# EAGLE schematic Sway (EAGLE 9.7.0)
SIM_ABSTOL: 1e-12; SIM_AC_SWEEP_TYPE: Dec; SIM_CHGTOL: 1e-15; SIM_GMIN: 1e-12; SIM_ITL1: 100; SIM_ITL2: 50; SIM_ITL4: 10; SIM_MAX_LIMIT: 2000; SIM_METHOD: TRAP; SIM_NUMPOINTS: 500; SIM_PIVREL: 1e-3; SIM_PIVTOL: 1e-13; SIM_RELTOL: 1e-3; SIM_RSHUNT: OFF; SIM_SRCSTEPS: 0; SIM_TEMPERATURE: 25.0; SIM_THEME: light; SIM_TRAN_AC_START: 1; SIM_TRTOL: 7; SIM_TYPE: Operating Point; SIM_VNTOL: 1e-6
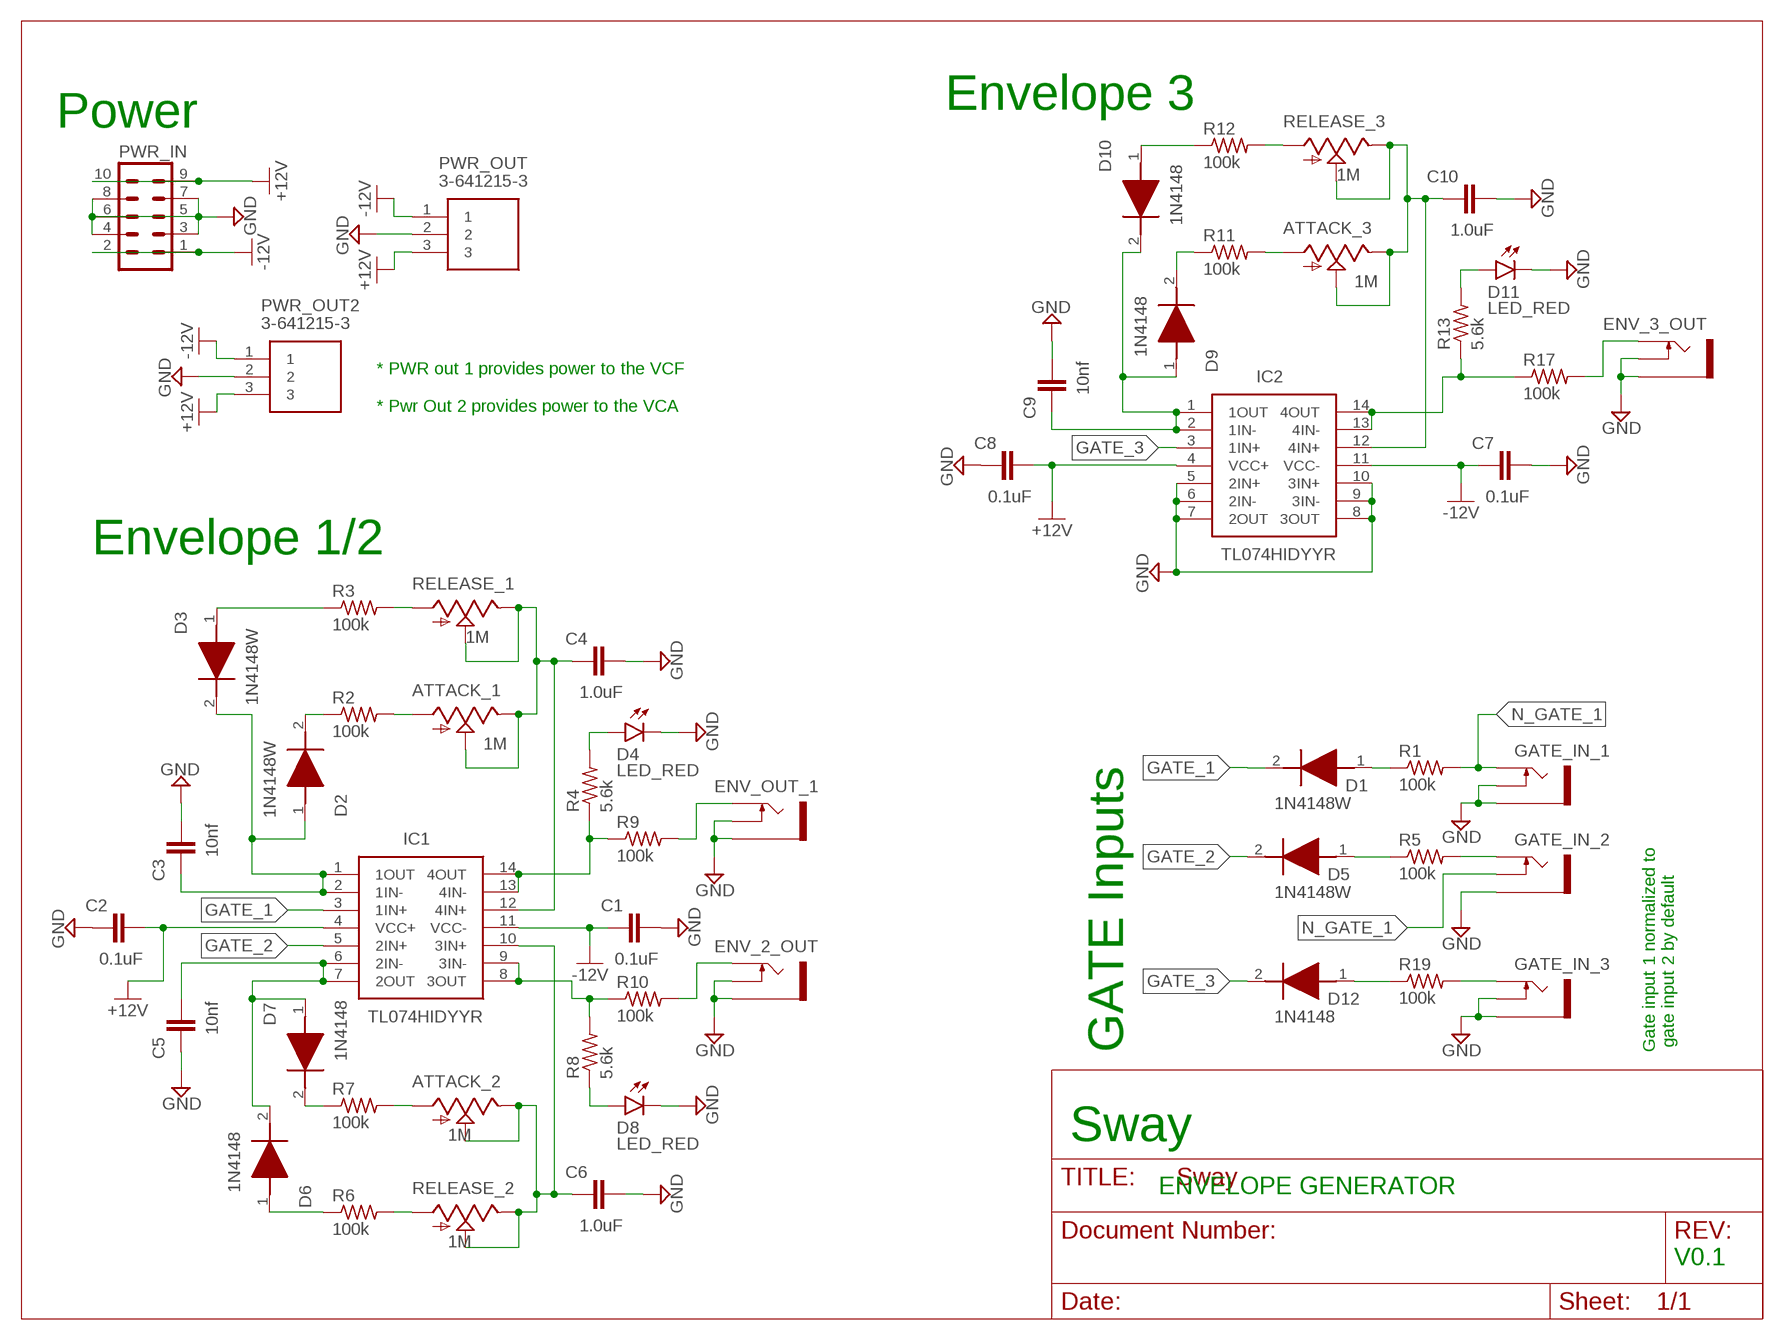
[diagram p0: schematic, sheet 1]

## Parts
ATTACK_1  1M  9MM_SNAP-IN_POT_  [9MM_SNAP-IN_POT]
ATTACK_2  1M  9MM_SNAP-IN_POT_  [9MM_SNAP-IN_POT]
ATTACK_3  1M  9MM_SNAP-IN_POT_  [9MM_SNAP-IN_POT]
C1  0.1uF  0.1UF-0402-16V-10%  [0402]
C2  0.1uF  0.1UF-0402-16V-10%  [0402]
C3  10nf  0.1UF-0402-16V-10%  [0402]
C4  1.0uF  1.0UF-0402-16V-10%  [0402]
C5  10nf  0.1UF-0402-16V-10%  [0402]
C6  1.0uF  1.0UF-0402-16V-10%  [0402]
C7  0.1uF  0.1UF-0402-16V-10%  [0402]
C8  0.1uF  0.1UF-0402-16V-10%  [0402]
C9  10nf  0.1UF-0402-16V-10%  [0402]
C10  1.0uF  1.0UF-0402-16V-10%  [0402]
D1  1N4148W  1N4148W-HG3_A-08  [SOD3716X135N]
D2  1N4148W  1N4148W-HG3_A-08  [SOD3716X135N]
D3  1N4148W  1N4148W-HG3_A-08  [SOD3716X135N]
D4  LED_RED  LED_RADIAL_RED  [LEDRD254W60D565H860B]
D5  1N4148W  1N4148W-HG3_A-08  [SOD3716X135N]
D6  1N4148  1N4148W-HG3_A-08  [SOD3716X135N]
D7  1N4148  1N4148W-HG3_A-08  [SOD3716X135N]
D8  LED_RED  LED_RADIAL_RED  [LEDRD254W60D565H860B]
D9  1N4148  1N4148W-HG3_A-08  [SOD3716X135N]
D10  1N4148  1N4148W-HG3_A-08  [SOD3716X135N]
D11  LED_RED  LED_RADIAL_RED  [LEDRD254W60D565H860B]
D12  1N4148  1N4148W-HG3_A-08  [SOD3716X135N]
ENV_2_OUT  THONKICONNNEW  [WQP-PJ301M-12_JACK]
ENV_3_OUT  THONKICONNNEW  [WQP-PJ301M-12_JACK]
ENV_OUT_1  THONKICONNNEW  [WQP-PJ301M-12_JACK]
GATE_IN_1  THONKICONNNEW  [WQP-PJ301M-12_JACK]
GATE_IN_2  THONKICONNNEW  [WQP-PJ301M-12_JACK]
GATE_IN_3  THONKICONNNEW  [WQP-PJ301M-12_JACK]
IC1  TL074HIDYYR  [SOP50P326X110-14N]
IC2  TL074HIDYYR  [SOP50P326X110-14N]
PWR_IN  EURO_POWER_HEADERREGULAR  [EURO_POWER_HEADER]
PWR_OUT  3-641215-3  [SHDR3W66P0X254_1X3_762X572X104]
PWR_OUT2  3-641215-3  [SHDR3W66P0X254_1X3_762X572X104]
R1  100k  R-US_CHIP-0402(1005-METRIC)  [RESC1005X40]
R2  100k  R-US_CHIP-0402(1005-METRIC)  [RESC1005X40]
R3  100k  R-US_CHIP-0402(1005-METRIC)  [RESC1005X40]
R4  5.6k  R-US_CHIP-0402(1005-METRIC)  [RESC1005X40]
R5  100k  R-US_CHIP-0402(1005-METRIC)  [RESC1005X40]
R6  100k  R-US_CHIP-0402(1005-METRIC)  [RESC1005X40]
R7  100k  R-US_CHIP-0402(1005-METRIC)  [RESC1005X40]
R8  5.6k  R-US_CHIP-0402(1005-METRIC)  [RESC1005X40]
R9  100k  R-US_CHIP-0402(1005-METRIC)  [RESC1005X40]
R10  100k  R-US_CHIP-0402(1005-METRIC)  [RESC1005X40]
R11  100k  R-US_CHIP-0402(1005-METRIC)  [RESC1005X40]
R12  100k  R-US_CHIP-0402(1005-METRIC)  [RESC1005X40]
R13  5.6k  R-US_CHIP-0402(1005-METRIC)  [RESC1005X40]
R17  100k  R-US_CHIP-0402(1005-METRIC)  [RESC1005X40]
R19  100k  R-US_CHIP-0402(1005-METRIC)  [RESC1005X40]
RELEASE_1  1M  9MM_SNAP-IN_POT_  [9MM_SNAP-IN_POT]
RELEASE_2  1M  9MM_SNAP-IN_POT_  [9MM_SNAP-IN_POT]
RELEASE_3  1M  9MM_SNAP-IN_POT_  [9MM_SNAP-IN_POT]

## Nets
+12V: C2.2 C8.2 IC1.4(VCC+) IC2.4(VCC+) PWR_IN.9 PWR_IN.10 PWR_OUT2.3 PWR_OUT.3
-12V: C1.1 C7.1 IC1.11(VCC-) IC2.11(VCC-) PWR_IN.1 PWR_IN.2 PWR_OUT2.1 PWR_OUT.1
ENV_1_OUT1: IC2.13(4IN-) IC2.14(4OUT) R13.1 R17.1
ENV_2_OUT: IC1.8(3OUT) IC1.9(3IN-) R8.2 R10.1
GATE_1: D1.2(K) IC1.3(1IN+)
GATE_2: D5.2(K) IC1.5(2IN+)
GATE_3: D12.2(K) IC2.3(1IN+)
GND: C1.2 C2.1 C3.2 C4.2 C5.1 C6.2 C7.2 C8.1 C9.2 C10.2 D4.2(C) D8.2(C) D11.2(C) ENV_2_OUT.P$2_SWITCH(SWITCH) ENV_2_OUT.P$3_SLEEVE(SLEEVE) ENV_3_OUT.P$2_SWITCH(SWITCH) ENV_3_OUT.P$3_SLEEVE(SLEEVE) ENV_OUT_1.P$2_SWITCH(SWITCH) ENV_OUT_1.P$3_SLEEVE(SLEEVE) GATE_IN_1.P$2_SWITCH(SWITCH) GATE_IN_1.P$3_SLEEVE(SLEEVE) GATE_IN_2.P$3_SLEEVE(SLEEVE) GATE_IN_3.P$2_SWITCH(SWITCH) GATE_IN_3.P$3_SLEEVE(SLEEVE) IC2.5(2IN+) IC2.6(2IN-) IC2.7(2OUT) IC2.8(3OUT) IC2.9(3IN-) IC2.10(3IN+) PWR_IN.3 PWR_IN.4 PWR_IN.5 PWR_IN.6 PWR_IN.7 PWR_IN.8 PWR_OUT2.2 PWR_OUT.2
N$1: C5.2 D6.2(K) D7.1(A) IC1.6(2IN-) IC1.7(2OUT)
N$2: D1.1(A) R1.1
N$3: C3.1 D2.1(A) D3.2(K) IC1.1(1OUT) IC1.2(1IN-)
N$4: GATE_IN_2.P$1_TIP(TIP) R5.2
N$5: ATTACK_1.2(S) ATTACK_1.3(E) C4.1 IC1.12(4IN+) RELEASE_1.2(S) RELEASE_1.3(E)
N$6: D2.2(K) R2.1
N$7: ATTACK_1.1(A) R2.2
N$8: D3.1(A) R3.1
N$9: R3.2 RELEASE_1.1(A)
N$10: D4.1(A) R4.2
N$11: D5.1(A) R5.1
N$12: C9.1 D9.1(A) D10.2(K) IC2.1(1OUT) IC2.2(1IN-)
N$13: D6.1(A) R6.1
N$14: R6.2 RELEASE_2.1(A)
N$15: D7.2(K) R7.1
N$16: ATTACK_2.2(S) ATTACK_2.3(E) C6.1 IC1.10(3IN+) RELEASE_2.2(S) RELEASE_2.3(E)
N$17: ATTACK_2.1(A) R7.2
N$18: D8.1(A) R8.1
N$19: ENV_2_OUT.P$1_TIP(TIP) R10.2
N$20: ATTACK_3.2(S) ATTACK_3.3(E) C10.1 IC2.12(4IN+) RELEASE_3.2(S) RELEASE_3.3(E)
N$21: D9.2(K) R11.1
N$22: ATTACK_3.1(A) R11.2
N$23: D10.1(A) R12.1
N$24: R12.2 RELEASE_3.1(A)
N$25: D11.1(A) R13.2
N$26: ENV_OUT_1.P$1_TIP(TIP) R9.2
N$27: IC1.13(4IN-) IC1.14(4OUT) R4.1 R9.1
N$34: D12.1(A) R19.1
N_GATE_1: GATE_IN_1.P$1_TIP(TIP) GATE_IN_2.P$2_SWITCH(SWITCH) R1.2
N_GATE_2: ENV_3_OUT.P$1_TIP(TIP) R17.2
N_GATE_3: GATE_IN_3.P$1_TIP(TIP) R19.2

## Notes on the sheet
- Envelope 3
- Power
- * PWR out 1 provides power to the VCF
  
  * Pwr Out 2 provides power to the VCA
- Envelope 1/2
- GATE Inputs
- Gate input 1 normalized to
   gate input 2 by default
- Sway
- ENVELOPE GENERATOR
- V0.1

## Library data of the parts
ATTACK_1-ATTACK_3 RELEASE_1-RELEASE_3 = MusicThingModular:9MM_SNAP-IN_POT: 9mm vertical snap-in pot, Alpha / Panasonic style
C1 C2 C7 C8 = SparkFun-Capacitors:0.1UF: 0.1µF ceramic capacitors A capacitor is a passive two-terminal electrical component used to store electrical energy temporarily in an electric field.; PROD_ID: CAP-12416
C3 C5 C9 = SparkFun-Capacitors:0.1UF: 0.1µF ceramic capacitors A capacitor is a passive two-terminal electrical component used to store electrical energy temporarily in an electric field.; PROD_ID: CAP-12416; VALUE: 0.1uF
C4 C6 C10 = SparkFun-Capacitors:1.0UF: 1µF ceramic capacitors A capacitor is a passive two-terminal electrical component used to store electrical energy temporarily in an electric field.; PROD_ID: CAP-12417
D1-D3 D5-D7 D9 D10 D12 = 1N4148W-HG3_A-08:1N4148W-HG3_A-08: Small Signal Switching Diodes SOD-123 1N4148W-G3-18. No. 10 000. (8 mm tape on 13" reel). 10 000. Source: Datasheet <https://www.vishay.com/docs/86357/1n4148w-g.pdf>; DESCRIPTION: Small Signal Switching Diodes SOD-123 1N4148W-G3-18. No. 10 000. (8 mm tape on 13" reel). 10 000.; HEIGHT: 1.35mm; MANUFACTURER_NAME: Vishay; MANUFACTURER_PART_NUMBER: 1N4148W-HG3_A-08; MOUSER_PART_NUMBER: 78-1N4148W-HG3_A-08; MOUSER_PRICE-STOCK: https://www.mouser.co.uk/ProductDetail/Vishay/1N4148W-HG3_A-08?qs=Imq1NPwxi77PuyLGBhrVtQ%3D%3D
D4 D8 D11 = Tinkercad:LED_RADIAL: LED - Generic; CATEGORY: Opto-Electronic; SUB-CATEGORY: LED
ENV_2_OUT ENV_3_OUT GATE_IN_1-GATE_IN_3 = MusicThingModular:THONKICONN: 3.5mm socket for Eurorack modular synths; SPICEMODEL: GATE_IN_1; SPICEMODELTEXT: **********************\n* Autodesk EAGLE - SPICE Model File\n* Author:\n* Date: \n**********************\n.SUBCKT GATE_IN_1 T S SW\n* Assume normally closed switch (SW → T when unplugged)\n* Always connect sleeve\nRsleeve S 0 0.001\n* Connect switch to tip if no plug\nRnorm SW T 1\n* Patch cable overrides switch (comment one of these in/out based on mode)\nRpatched TIP_SRC T 0.001\n.ENDS GATE_IN_1; SPICEPREFIX: X
ENV_OUT_1 = MusicThingModular:THONKICONN: 3.5mm socket for Eurorack modular synths
IC1 IC2 = TL074HIDYYR:TL074HIDYYR: Operational Amplifiers - Op Amps Quad, 40-V, 5-MHz, 4-mV offset voltage, 20-V/us, In to V+ op amp with -40 C to 125 C operation Source: Datasheet <https://www.ti.com/lit/ds/symlink/tl074.pdf?HQS=dis-mous-null-mousermode-dsf-pf-null-wwe&ts=1653289518838&ref_url=https%3A%2F%2Fwww.mouser.es%2F>; DESCRIPTION: Operational Amplifiers - Op Amps Quad, 40-V, 5-MHz, 4-mV offset voltage, 20-V/us, In to V+ op amp with -40 C to 125 C operation; HEIGHT: 1.1mm; MANUFACTURER_NAME: Texas Instruments; MANUFACTURER_PART_NUMBER: TL074HIDYYR; MOUSER_PART_NUMBER: 595-TL074HIDYYR; MOUSER_PRICE-STOCK: https://www.mouser.co.uk/ProductDetail/Texas-Instruments/TL074HIDYYR?qs=Li%252BoUPsLEnudP2MOdP5hYw%3D%3D
PWR_IN = MusicThingModular:EURO_POWER_HEADER: Power Header 10 pin power header for Eurorack Power Supplies Variants with fatter pads for easier soldering, and the LOCK variant which has 5mil offset pins to hold the component in place before soldering
PWR_OUT PWR_OUT2 = 3-641215-3:3-641215-3: 03P MTA100 HDR ASSY FL/ST 30AU Source: Datasheet <https://www.te.com/commerce/DocumentDelivery/DDEController?Action=srchrtrv&DocNm=641215&DocType=Customer Drawing&DocLang=English&PartCntxt=3-641215-3&DocFormat=pdf>; DESCRIPTION: 03P MTA100 HDR ASSY FL/ST 30AU; HEIGHT: 10.414mm; MANUFACTURER_NAME: TE Connectivity; MANUFACTURER_PART_NUMBER: 3-641215-3; MOUSER_PART_NUMBER: 571-3-641215-3; MOUSER_PRICE-STOCK: https://www.mouser.co.uk/ProductDetail/TE-Connectivity-AMP/3-641215-3?qs=VKrXD49J9EoDO6g44HrMVw%3D%3D; SPICEMODEL: PWR_OUT; SPICEMODELTEXT: **********************\n* Autodesk EAGLE - SPICE Model File\n* Author:\n* Date: \n**********************\n.SUBCKT PWR_OUT 1 2 3\n* Pin 1 = -12V\n* Pin 2 = GND\n* Pin 3 = +12V\n* Tie pins to global rails\nRout1 1 VNEG 0.001\nRout2 2 0 0.001\nRout3 3 VPOS 0.001\n.ENDS PWR_OUT; SPICEPREFIX: X
R1-R13 R17 R19 = Tutorial - Fusion 360:R-US: Resistor Fixed - ANSI; CATEGORY: Resistor; SUB-CATEGORY: Fixed